# EAGLE design project2 (EAGLE 9.6.2)
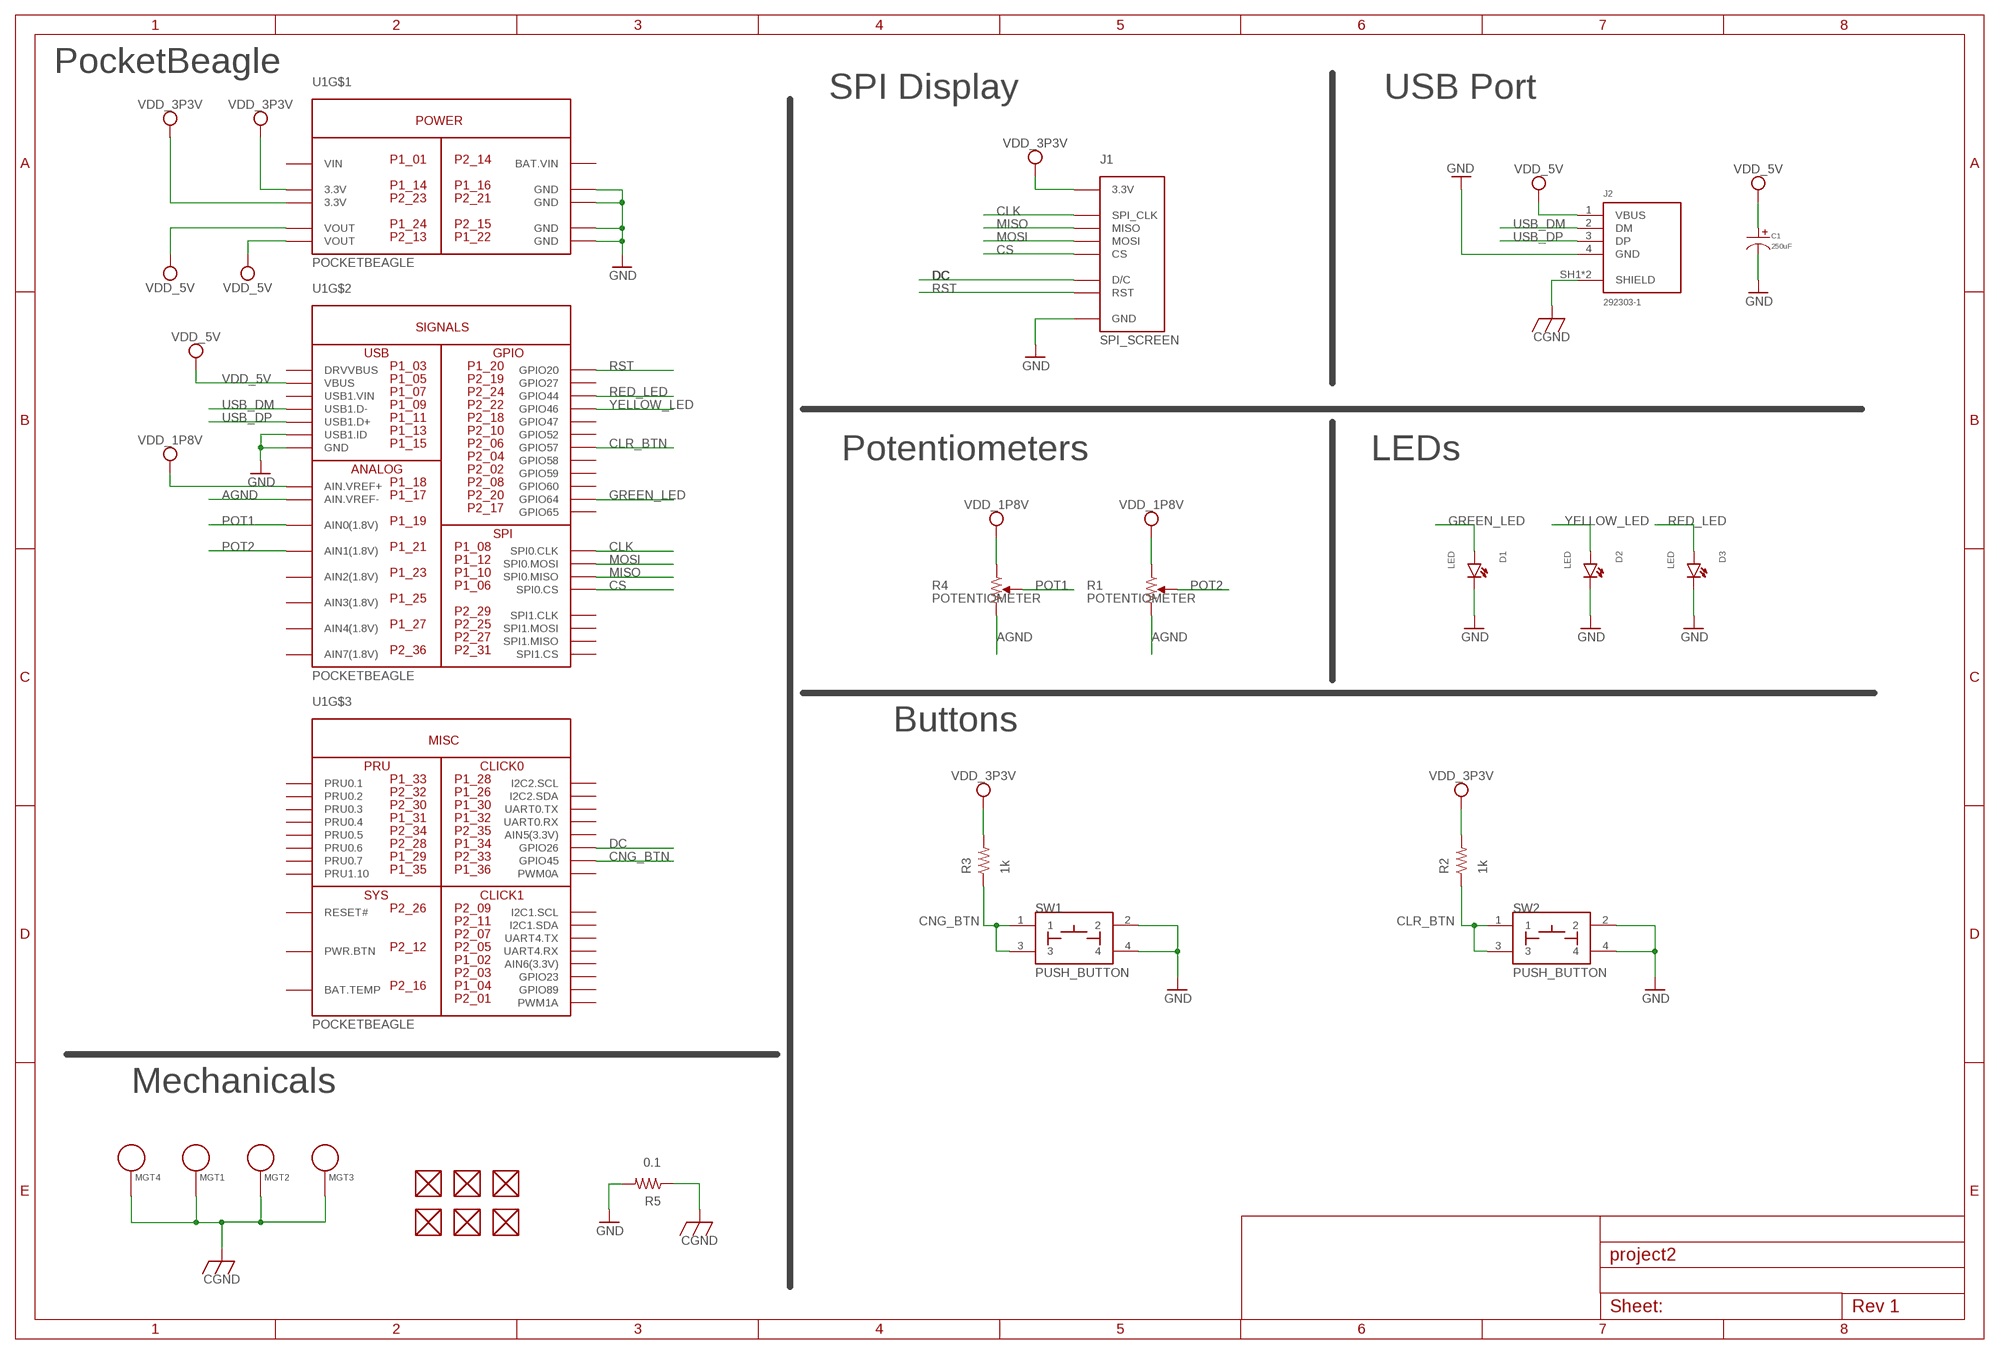
[diagram p0: schematic, sheet 1]

## Parts
C1  250uF  CAPACITOR_P_10MM  [CP10MM]
D1  LED  [EIA-STD]
D2  LED  [EIA-STD]
D3  LED  [EIA-STD]
FUD1  FIDUCIAL  [FIDUCIAL_40MIL]
FUD2  FIDUCIAL  [FIDUCIAL_40MIL]
FUD3  FIDUCIAL  [FIDUCIAL_40MIL]
FUD4  FIDUCIAL  [FIDUCIAL_40MIL]
FUD5  FIDUCIAL  [FIDUCIAL_40MIL]
FUD6  FIDUCIAL  [FIDUCIAL_40MIL]
J1  SPI_SCREEN  [SPI_SCREEN]
J2  292303-1  [TE_292303-1]
MGT1  MOUNTING_HOLE  [MOUNTING_HOLE]
MGT2  MOUNTING_HOLE  [MOUNTING_HOLE]
MGT3  MOUNTING_HOLE  [MOUNTING_HOLE]
MGT4  MOUNTING_HOLE  [MOUNTING_HOLE]
R1  POTENTIOMETER  [POT-PO90S]
R2  1k  R_R0603  [R0603]
R3  1k  R_R0603  [R0603]
R4  POTENTIOMETER  [POT-PO90S]
R5  0.1  R_R0603  [R0603]
SW1  PUSH_BUTTON  [BUTTON_12.5MM]
SW2  PUSH_BUTTON  [BUTTON_12.5MM]
U1  POCKETBEAGLE  [POCKETBEAGLE]

## Nets
AGND: R1.CW R4.CW U1.17@P1(AIN.VREF-)
CGND: J2.SH1(SHIELD) J2.SH2(SHIELD) MGT1.P$1 MGT2.P$1 MGT3.P$1 MGT4.P$1 R5.1
CLK: J1.4@JP2(SPI_CLK) U1.8@P1(SPI0.CLK)
CLR_BTN: R2.1 SW2.1 SW2.3 U1.6@P2(GPIO57)
CNG_BTN: R3.1 SW1.1 SW1.3 U1.33@P2(GPIO45)
CS: J1.7@JP2(CS) U1.6@P1(SPI0.CS)
DC: J1.8@JP2(D/C) U1.34@P1(GPIO26)
GND: C1.P$2 D1.CATHODE D2.CATHODE D3.CATHODE J1.1@JP2(GND) J2.4(GND) R5.2 SW1.2 SW1.4 SW2.2 SW2.4 U1.13@P1(USB1.ID) U1.15@P1(GND) U1.15@P2(GND) U1.16@P1(GND) U1.21@P2(GND) U1.22@P1(GND)
GREEN_LED: D1.ANODE U1.20@P2(GPIO64)
MISO: J1.5@JP2(MISO) U1.10@P1(SPI0.MISO)
MOSI: J1.6@JP2(MOSI) U1.12@P1(SPI0.MOSI)
POT1: R4.S U1.19@P1(AIN0(1.8V))
POT2: R1.S U1.21@P1(AIN1(1.8V))
RED_LED: D3.ANODE U1.24@P2(GPIO44)
RST: J1.9@JP2(RST) U1.20@P1(GPIO20)
USB_DM: J2.2(DM) U1.9@P1(USB1.D-)
USB_DP: J2.3(DP) U1.11@P1(USB1.D+)
VDD_1P8V: R1.CCW R4.CCW U1.18@P1(AIN.VREF+)
VDD_3P3V: J1.3@JP2(3.3V) R2.2 R3.2 U1.14@P1(3.3V) U1.23@P2(3.3V)
VDD_5V: C1.P$1 J2.1(VBUS) U1.5@P1(VBUS) U1.13@P2(VOUT) U1.24@P1(VOUT)
YELLOW_LED: D2.ANODE U1.22@P2(GPIO46)
Unconnected: FUD1.P$1 FUD2.P$1 FUD3.P$1 FUD4.P$1 FUD5.P$1 FUD6.P$1 U1.1@P2(PWM1A) U1.2@P1(AIN6(3.3V)) U1.2@P2(GPIO59) U1.3@P1(DRVVBUS) U1.3@P2(GPIO23) U1.4@P1(GPIO89) U1.4@P2(GPIO58) U1.5@P2(UART4.RX) U1.7@P1(USB1.VIN) U1.7@P2(UART4.TX) U1.8@P2(GPIO60) U1.9@P2(I2C1.SCL) U1.10@P2(GPIO52) U1.11@P2(I2C1.SDA) U1.12@P2(PWR.BTN) U1.16@P2(BAT.TEMP) U1.17@P2(GPIO65) U1.18@P2(GPIO47) U1.19@P2(GPIO27) U1.23@P1(AIN2(1.8V)) U1.25@P1(AIN3(1.8V)) U1.25@P2(SPI1.MOSI) U1.26@P1(I2C2.SDA) U1.26@P2(RESET#) U1.27@P1(AIN4(1.8V)) U1.27@P2(SPI1.MISO) U1.28@P1(I2C2.SCL) U1.28@P2(PRU0.6) U1.29@P1(PRU0.7) U1.29@P2(SPI1.CLK) U1.30@P1(UART0.TX) U1.30@P2(PRU0.3) U1.31@P1(PRU0.4) U1.31@P2(SPI1.CS) U1.32@P1(UART0.RX) U1.32@P2(PRU0.2) U1.33@P1(PRU0.1) U1.34@P2(PRU0.5) U1.35@P1(PRU1.10) U1.35@P2(AIN5(3.3V)) U1.36@P1(PWM0A) U1.36@P2(AIN7(1.8V))

## Notes on the sheet
- PocketBeagle
- SPI Display | USB Port
- Potentiometers | LEDs
- Buttons
- Mechanicals

## Power pins joined to a net without a drawn wire
BAT.VIN: U1.14@P2(BAT.VIN)
VIN: U1.1@P1(VIN)

## Library data of the parts
C1 = combo_lock:CAPACITOR_P: Library: MF_Passives Description: Device for Polarized Capacitors. Manufacture part number (MPN), Voltage Rating, and Tolerance can be added via Attributes. Check https://factory.macrofab.com/parts for the house parts list.; POPULATE: 1
D1-D3 = project2:LED: EIA-STD LED, LTST-C191TBKT
FUD1-FUD6 = project2:FIDUCIAL
J1 = project2:SPI_SCREEN: 2.8" Adafruit SPI Display
J2 = project2:292303-1: CONN USB RECEPT R/A TYPE A 4POS Check prices <https://pricing.snapeda.com/parts/292303-1/TE%20Connectivity/view-part?ref=eda>; AVAILABILITY: In Stock; COMMENT: 292303-1; DESCRIPTION: Conn; Data; USB; Recept; 2.0; 4 Pos; 1 Port; Rt Angle; A Ser; Tin over Copper; MF: TE Connectivity; MP: 292303-1; PACKAGE: None; PRICE: None; PURCHASE-URL: https://pricing.snapeda.com/search/part/292303-1/?ref=eda
MGT1-MGT4 = project2:MOUNTING_HOLE: Chassis Mounting Hole w/GND connection ability
R1 R4 = project2:POTENTIOMETER: Potentiometer - Examples: P090S-14T20BR10K (987-1277-ND)
R2 R3 R5 = project2:R_: RESISTOR, American symbol
SW1 SW2 = project2:PUSH_BUTTON
U1 = project2:POCKETBEAGLE: PocketBeagle

## Board
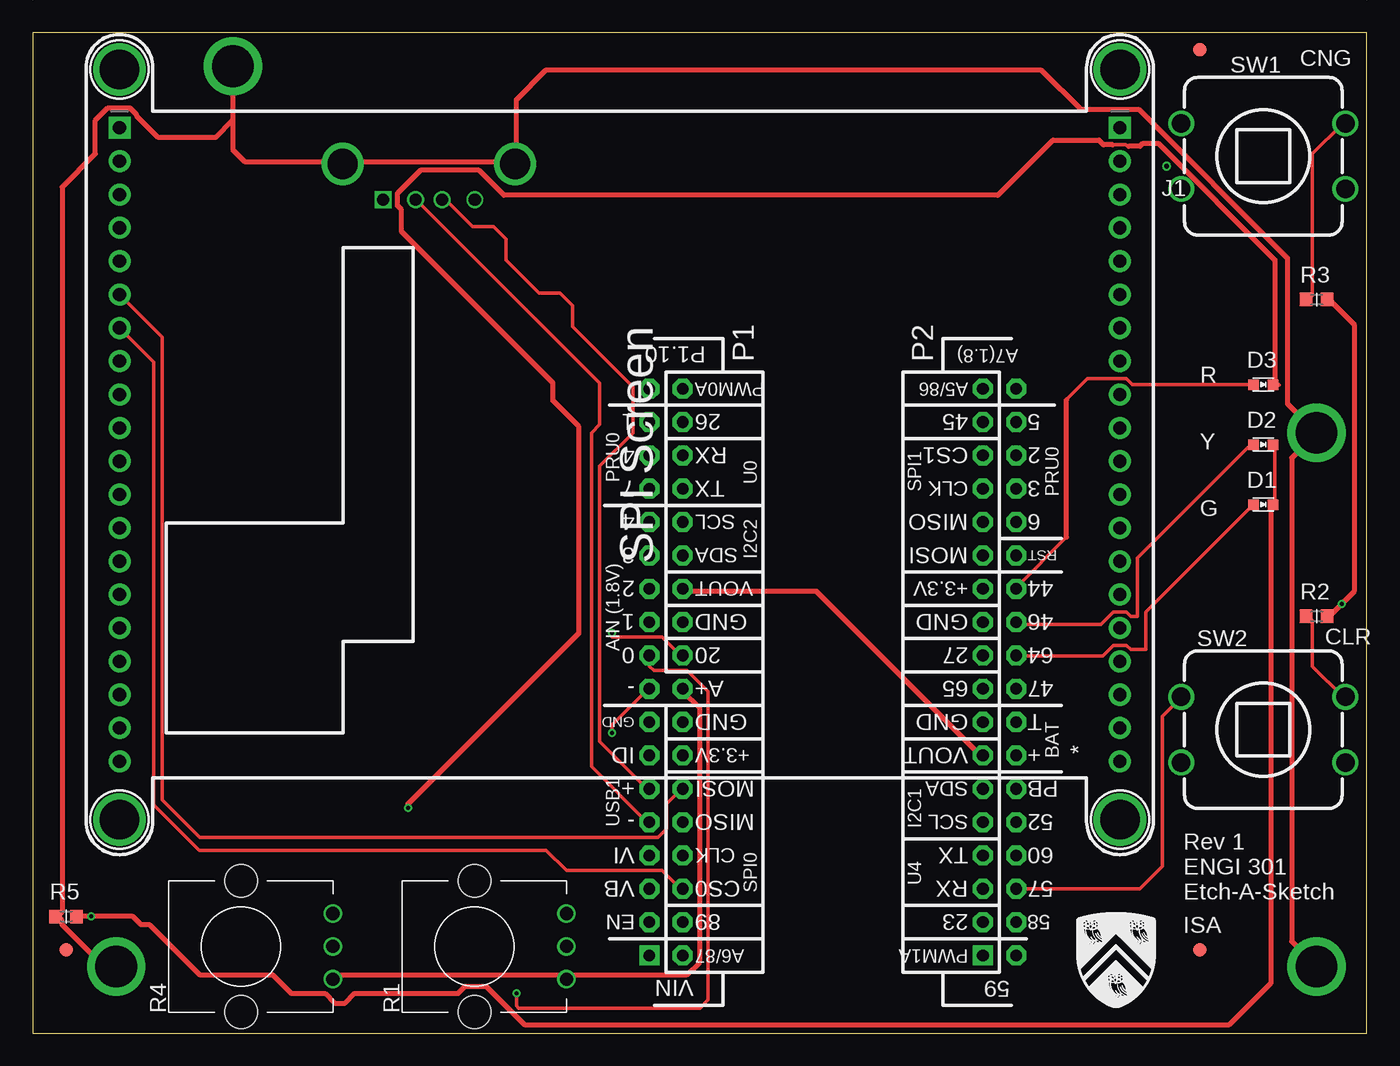
[diagram p1: board, top side]
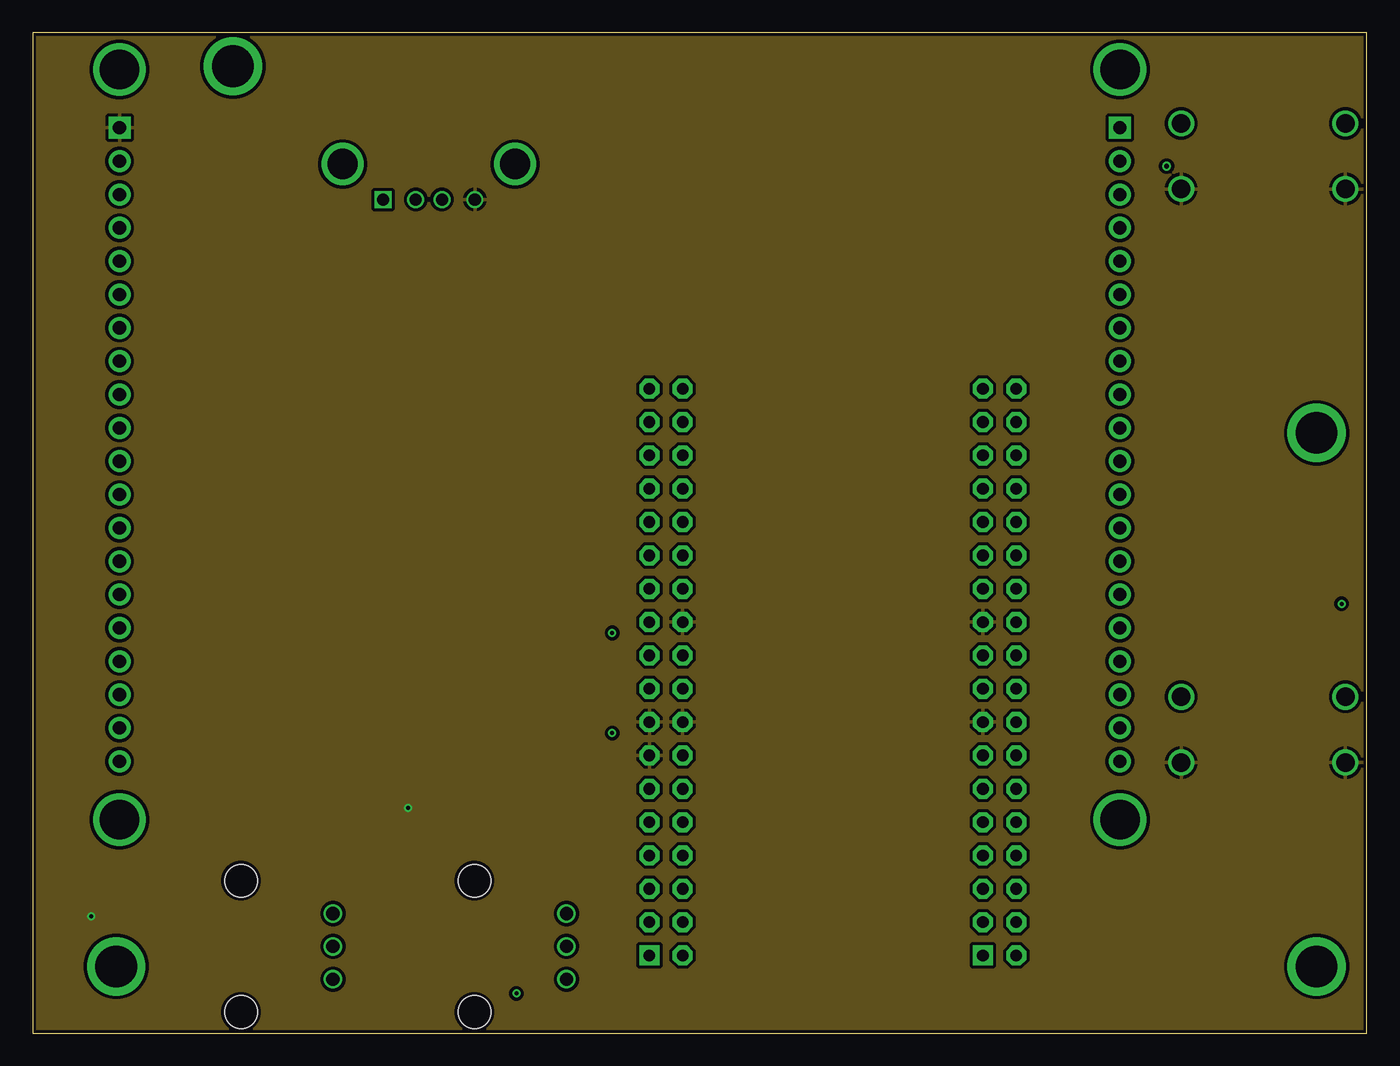
[diagram p2: board, inner layer Route2]
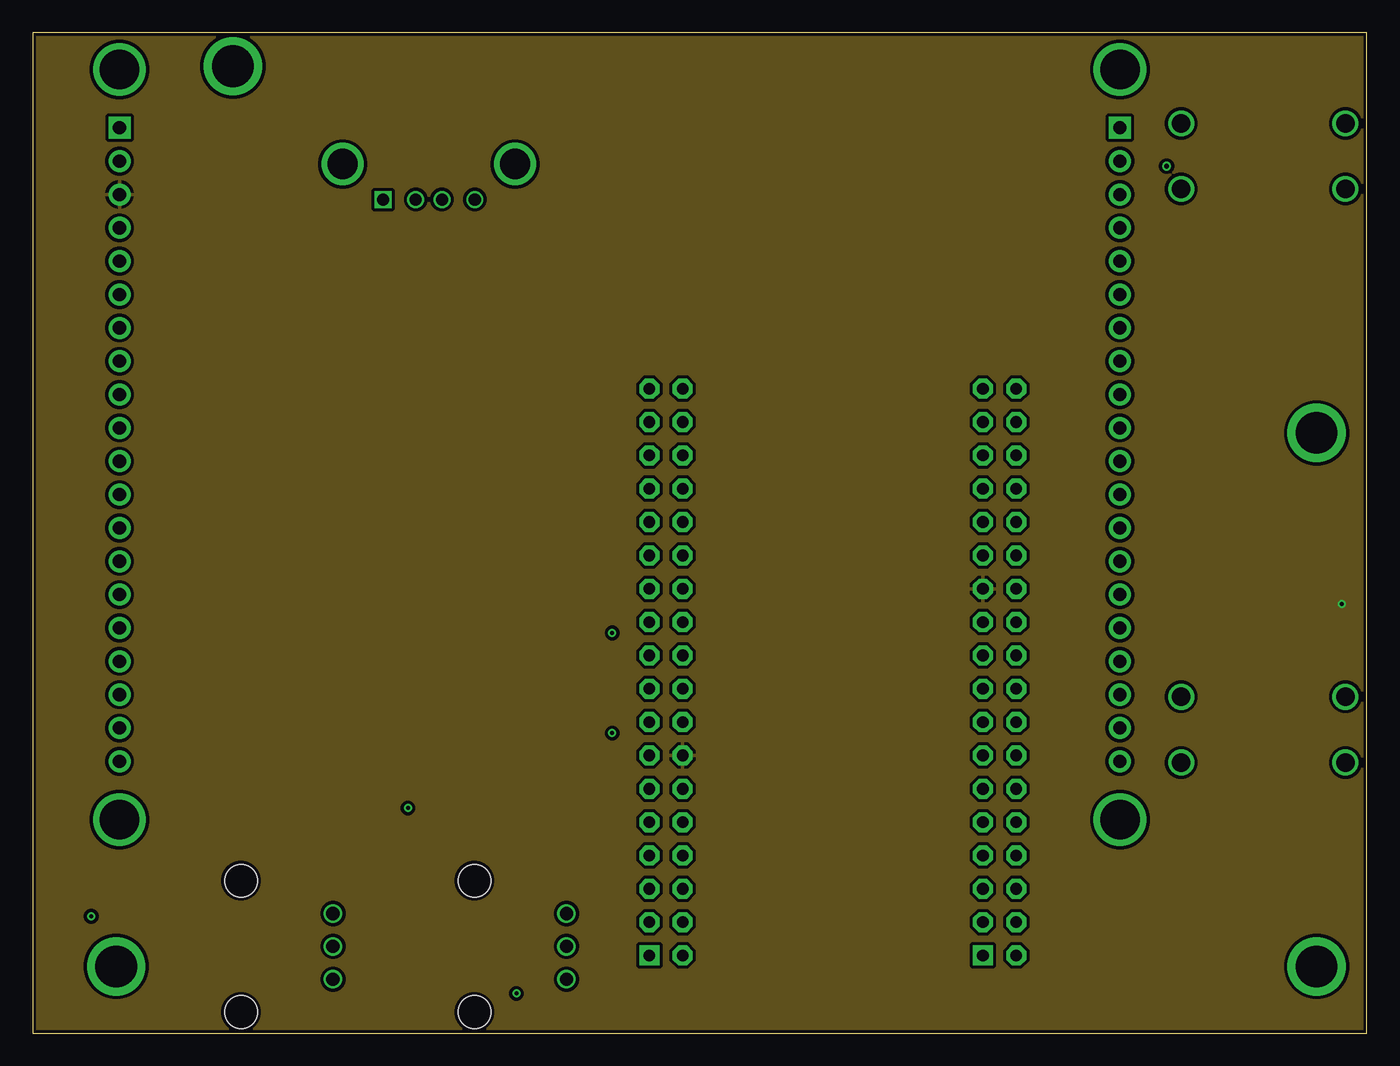
[diagram p3: board, inner layer Route15]
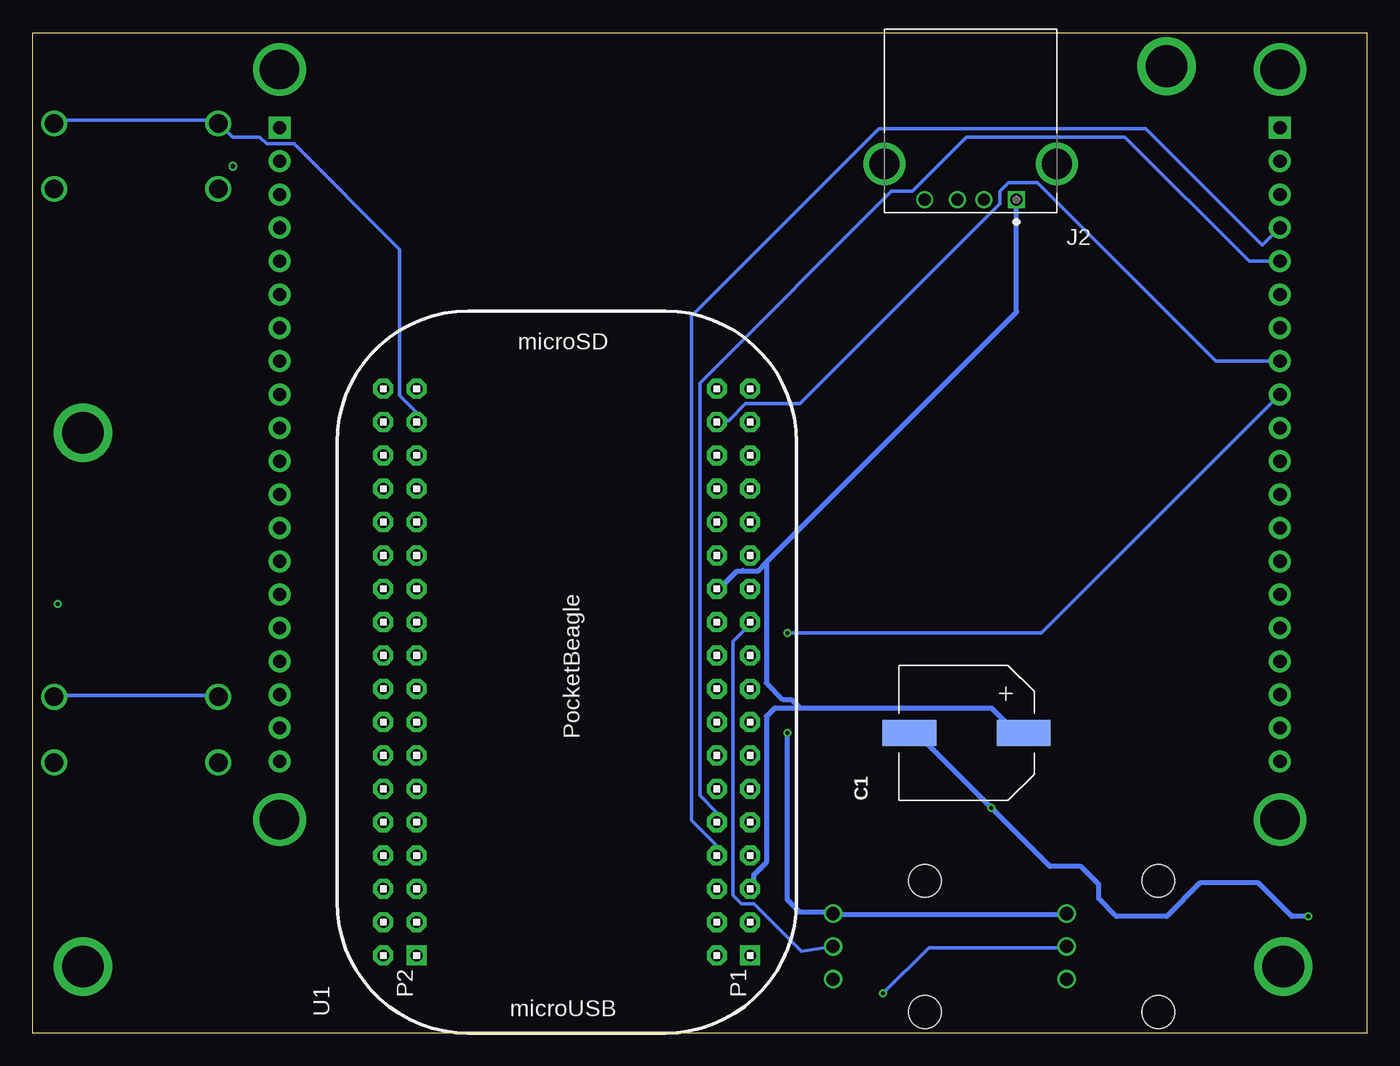
[diagram p4: board, bottom side, seen from below]

Size 101.6 x 76.2 mm. Coordinates in mm from the lower left corner, seen from the top.
Outline: 0,0 101.6,0 101.6,76.2 0,76.2 0,0
Copper layers (1*2*15*16): Top 0.035mm / dielectric 0.23mm / Route2 0.035mm / dielectric 0.93mm / Route15 0.035mm / dielectric 0.23mm / Bottom 0.035mm
Design rules "ENGI301_4lyr": minimum track width 10mil, minimum drill 12mil, track to track 10mil, track to pad 10mil, pad to pad 10mil, via to via 10mil, smd to smd 10mil, copper to edge 10mil, drill to drill 12mil, minimum pad ring 6mil, minimum via ring 6mil, stop-mask expansion 3mil, vias tented up to drill 25mil, thermal gap 10mil

### Footprints (pad centres in the part's own frame; a part is rotated, then mirrored left to right if it is on the bottom)
CP10MM = smd 2 x 4.1: P$1 0,-4.35; P$2 0,4.35
EIA-STD = smd 0.8 x 0.8: ANODE -0.75,0; CATHODE 0.75,0
FIDUCIAL_40MIL = smd 1.016 x 1.016: P$1 0,0
SPI_SCREEN = drill 1 pad 1.676 square: 1@JP1 -24.13,38.1; 1@JP2 -24.13,-38.1 | drill 1 pad 1.676: 2@JP1 -21.59,38.1; 2@JP2 -21.59,-38.1; 3@JP1 -19.05,38.1; 3@JP2 -19.05,-38.1; 4@JP1 -16.51,38.1; 4@JP2 -16.51,-38.1; 5@JP1 -13.97,38.1; 5@JP2 -13.97,-38.1; 6@JP1 -11.43,38.1; 6@JP2 -11.43,-38.1; 7@JP1 -8.89,38.1; 7@JP2 -8.89,-38.1; 8@JP1 -6.35,38.1; 8@JP2 -6.35,-38.1; 9@JP1 -3.81,38.1; 9@JP2 -3.81,-38.1; 10@JP1 -1.27,38.1; 10@JP2 -1.27,-38.1; 11@JP1 1.27,38.1; 11@JP2 1.27,-38.1; 12@JP1 3.81,38.1; 12@JP2 3.81,-38.1; 13@JP1 6.35,38.1; 13@JP2 6.35,-38.1; 14@JP1 8.89,38.1; 14@JP2 8.89,-38.1; 15@JP1 11.43,38.1; 15@JP2 11.43,-38.1; 16@JP1 13.97,38.1; 16@JP2 13.97,-38.1; 17@JP1 16.51,38.1; 17@JP2 16.51,-38.1; 18@JP1 19.05,38.1; 18@JP2 19.05,-38.1; 19@JP1 21.59,38.1; 19@JP2 21.59,-38.1; 20@JP1 24.13,38.1; 20@JP2 24.13,-38.1 | drill 3 pad 3.6: P$1@U$7 -28.575,-38.1; P$1@U$15 28.575,-38.1; P$1@U$16 -28.575,38.1; P$1@U$17 28.575,38.1
TE_292303-1 = drill 0.92 square: 1 0,0 | drill 0.92: 2 2.5,0; 3 4.5,0; 4 7,0 | drill 2.3: SH1 -3.07,-2.71; SH2 10.07,-2.71
MOUNTING_HOLE = drill 3.175 pad 4.445: P$1 0,0
POT-PO90S = drill 1: CCW -2.5,0; CW 2.5,0; S 0,0 | hole 2.5: -5,7; 5,7
R0603 = smd 0.95 x 1.031: 1 -0.8,0; 2 0.8,0
BUTTON_12.5MM = drill 1.4: 1 -6.25,2.5; 2 -6.25,-2.5; 3 6.25,2.5; 4 6.25,-2.5
POCKETBEAGLE = drill 0.889 pad 1.524 square: 1@P1 5.91,3.53; 1@P2 5.91,28.93 | drill 0.889 pad 1.524 octagon: 2@P1 5.91,6.07; 2@P2 5.91,31.47; 3@P1 8.45,3.53; 3@P2 8.45,28.93; 4@P1 8.45,6.07; 4@P2 8.45,31.47; 5@P1 10.99,3.53; 5@P2 10.99,28.93; 6@P1 10.99,6.07; 6@P2 10.99,31.47; 7@P1 13.53,3.53; 7@P2 13.53,28.93; 8@P1 13.53,6.07; 8@P2 13.53,31.47; 9@P1 16.07,3.53; 9@P2 16.07,28.93; 10@P1 16.07,6.07; 10@P2 16.07,31.47; 11@P1 18.61,3.53; 11@P2 18.61,28.93; 12@P1 18.61,6.07; 12@P2 18.61,31.47; 13@P1 21.15,3.53; 13@P2 21.15,28.93; 14@P1 21.15,6.07; 14@P2 21.15,31.47; 15@P1 23.69,3.53; 15@P2 23.69,28.93; 16@P1 23.69,6.07; 16@P2 23.69,31.47; 17@P1 26.23,3.53; 17@P2 26.23,28.93; 18@P1 26.23,6.07; 18@P2 26.23,31.47; 19@P1 28.77,3.53; 19@P2 28.77,28.93; 20@P1 28.77,6.07; 20@P2 28.77,31.47; 21@P1 31.31,3.53; 21@P2 31.31,28.93; 22@P1 31.31,6.07; 22@P2 31.31,31.47; 23@P1 33.85,3.53; 23@P2 33.85,28.93; 24@P1 33.85,6.07; 24@P2 33.85,31.47; 25@P1 36.39,3.53; 25@P2 36.39,28.93; 26@P1 36.39,6.07; 26@P2 36.39,31.47; 27@P1 38.93,3.53; 27@P2 38.93,28.93; 28@P1 38.93,6.07; 28@P2 38.93,31.47; 29@P1 41.47,3.53; 29@P2 41.47,28.93; 30@P1 41.47,6.07; 30@P2 41.47,31.47; 31@P1 44.01,3.53; 31@P2 44.01,28.93; 32@P1 44.01,6.07; 32@P2 44.01,31.47; 33@P1 46.55,3.53; 33@P2 46.55,28.93; 34@P1 46.55,6.07; 34@P2 46.55,31.47; 35@P1 49.09,3.53; 35@P2 49.09,28.93; 36@P1 49.09,6.07; 36@P2 49.09,31.47

### Placement (x,y rotation side)
C1  30.48,22.86 90 bottom
D1  93.73,40.26 0 top
D2  93.73,44.83 0 top
D3  93.73,49.4 0 top
FUD1  88.9,6.35 0 top
FUD2  2.54,6.35 0 top
FUD3  88.9,74.93 0 top
FUD4  40.64,-21.59 0 top  (outside the outline)
FUD5  40.64,-24.13 0 top  (outside the outline)
FUD6  40.64,-26.67 0 top  (outside the outline)
J1  44.7,44.83 270 top
J2  26.67,63.5 180 bottom
MGT1  6.35,5.08 0 top
MGT2  97.79,5.08 0 top
MGT3  97.79,45.72 0 top
MGT4  15.24,73.66 0 top
R1  40.64,6.6 90 top
R2  97.79,31.75 0 top
R3  97.79,55.88 0 top
R4  22.86,6.6 90 top
R5  2.54,8.89 0 top
SW1  93.73,66.8 0 top
SW2  93.73,23.11 0 top
U1  43.43,0 90 bottom

### Tracks (layer width: path | path; a pad name or v marks a point on that pad's centre or on a via)
AGND  (via drill 0.3)
  Top 0.254: v44.13,22.86 44.13,23.5 46.67,26.04 46.77,26.04 U1.17@P1
  Bottom 0.254: R1.CW 41.12,9.21
  Bottom 0.381: v44.13,22.86 44.13,10.16 43.18,9.21 41.12,9.21 | R4.CW 22.86,9.05 40.31,9.05 R1.CW
CGND
  Top 0.254: 1.91,8.89 R5.1 | 23.5,66.31 23.5,66.36 | J2.SH2 36.66,66.21
  Top 0.381: MGT2.P$1 95.89,6.99 95.89,43.81 MGT3.P$1 95.57,47.94 95.57,59.05 84.3,70.33 79.85,70.33 76.83,73.34 39.05,73.34 36.83,71.12 36.83,66.36 36.74,66.27 J2.SH2 | MGT1.P$1 5.4,5.08 2.22,8.26 2.22,8.57 1.91,8.89 2.22,9.21 2.22,64.45 4.76,66.99 4.76,69.53 5.71,70.48 7.38,70.48 7.89,69.98 7.89,69.9 9.53,68.26 13.97,68.26 15.24,69.53 | MGT4.P$1 15.24,69.53 | 15.24,69.53 15.24,67.31 16.19,66.36 23.5,66.36 | 23.5,66.31 J2.SH1 23.75,66.36 36.51,66.36 36.66,66.21
CLK
  Bottom 0.254: J1.4@JP2 7.94,60.01 16.83,68.9 37.15,68.9 51.44,54.61 51.44,16.19 49.53,14.29 49.53,13.65 49.5,13.63 U1.8@P1
CLR_BTN
  Top 0.254: R2.1 97.16,31.75 97.47,31.43 97.47,27.94 99.8,25.61 SW2.3 | U1.6@P2 84.33,10.99 86.04,12.7 86.04,24.13 87.48,25.56 SW2.1
  Bottom 0.254: SW2.1 87.58,25.72 99.69,25.72 99.8,25.61 SW2.3
CNG_BTN
  Top 0.254: R3.1 97.16,55.88 97.47,56.2 97.47,66.99 99.69,69.22 99.89,69.22 SW1.3
  Bottom 0.254: SW1.3 99.92,69.3 99.69,69.53 87.63,69.53 87.48,69.38 SW1.1 87.39,69.22 87.31,69.22 86.36,68.26 84.32,68.26 83.8,67.74 82.42,67.74 81.71,67.74 73.66,59.69 73.66,48.58 72.39,47.31 72.39,46.67 72.36,46.65 U1.33@P2
CS
  Top 0.254: J1.7@JP2 9.21,51.12 9.21,17.38 12.66,13.93 39.09,13.93 40.64,12.38 47.94,12.38 49.34,10.99 U1.6@P1
DC
  Bottom 0.254: U1.34@P1 49.34,46.55 49.21,46.67 48.58,46.67 47.31,47.94 43.18,47.94 27.94,63.18 27.94,64.14 27.3,64.77 25.08,64.77 11.49,51.18 J1.8@JP2
GND  (via drill 0.3)
  Top 0.254: 94.61,49.37 94.93,49.37 94.9,49.4 D3.CATHODE | D2.CATHODE 94.54,44.77 94.61,44.77 94.61,40.32 94.54,40.32 D1.CATHODE 94.48,40.18 94.3,40.01 | 83.47,67.56 83.39,67.56 83.27,67.68 82.25,67.68
  Top 0.381: R5.2 v4.45,8.89 7.62,8.89 8.26,8.26 8.89,8.26 12.7,4.45 18.26,4.45 19.68,3.02 22.25,3.02 22.99,2.29 23.77,2.29 24.51,3.02 32.41,3.02 32.94,3.55 34.53,3.55 37.45,0.64 91.12,0.64 94.3,3.81 94.3,40.01 | v28.57,17.14 28.57,17.46 41.59,30.48 41.59,46.2 39.61,48.18 39.61,49.53 28.08,61.06 28.08,62.72 27.78,63.02 27.78,63.98 29.53,65.72 33.97,65.72 35.88,63.82 73.5,63.82 77.71,68.02 81.21,68.02 81.55,67.68 82.25,67.68 | 94.61,49.37 94.61,58.9 85.77,67.74 84.51,67.74 84.33,67.56 83.47,67.56
  Bottom 0.254: 34.29,22.86 C1.P$2
  Bottom 0.381: 34.29,22.86 v28.57,17.14 24.13,12.7 21.78,12.7 20.41,11.34 20.41,10.25 19.05,8.89 15.24,8.89 12.7,11.43 8.26,11.43 5.71,8.89 v4.45,8.89
  pour Route2: -5.08,81.28 106.68,81.28 106.68,-5.08 -5.08,-5.08
GREEN_LED
  Top 0.254: D1.ANODE 92.72,40.01 92.71,40.01 84.77,32.07 84.77,29.21 83.64,29.21 83.31,29.54 82.3,29.54 81.5,28.74 74.93,28.74 U1.20@P2
MISO
  Bottom 0.254: U1.10@P1 49.5,16.17 49.53,16.19 49.53,16.83 50.8,18.1 50.8,49.53 36.2,64.14 34.61,64.14 30.48,68.26 18.41,68.26 8.95,58.8 J1.5@JP2
MOSI
  Top 0.254: J1.6@JP2 9.84,53.02 9.84,17.78 12.7,14.92 47.62,14.92 48.26,15.56 48.26,17.46 49.21,18.41 49.31,18.41 U1.12@P1
N$2  (via drill 0.35)
  other vias: 86.36,66.04
POT1  (via drill 0.3)
  Top 0.254: U1.19@P1 46.99,28.74 46.99,27.94 47.31,27.62 49.85,27.62 51.44,26.04 51.44,2.54 50.8,1.91 36.99,1.91 36.83,2.06 v36.83,3.02
  Bottom 0.254: v36.83,3.02 33.34,6.51 22.86,6.51 R4.S
POT2
  Bottom 0.254: U1.21@P1 46.99,31.28 46.99,31.11 48.26,29.84 48.26,10.48 47.62,9.84 46.67,9.84 43.05,6.22 R1.S
RED_LED
  Top 0.254: U1.24@P2 74.9,33.95 78.74,37.78 | D3.ANODE 83.77,49.4 83.31,49.86 80.34,49.86 78.74,48.26
  Top 0.381: 78.74,37.78 78.74,48.26
RST  (via drill 0.3)
  Top 0.254: v44.13,30.48 44.13,30.16 47.94,30.16 49.34,28.77 U1.20@P1
  Bottom 0.254: v44.13,30.48 24.77,30.48 J1.9@JP2
USB_DM
  Top 0.254: J2.2 29.21,63.5 43.18,49.53 43.18,46.35 42.55,45.72 42.55,20.32 46.8,16.07 U1.9@P1
USB_DP
  Top 0.254: J2.3 31.43,63.5 33.5,61.44 35.08,61.44 36.04,60.48 36.04,58.9 38.58,56.36 40.16,56.36 41.12,55.4 41.12,53.82 45.72,49.21 45.72,45.72 43.18,43.18 43.18,22.23 46.8,18.61 U1.11@P1
VDD_1P8V
  Top 0.381: 40.64,4.45 22.86,4.45 R4.CCW | 40.64,4.45 49.85,4.45 50.8,5.4 50.8,24.77 49.53,26.04 49.53,26.2 U1.18@P1 | 40.64,4.45 R1.CCW
VDD_3P3V  (via drill 0.3)
  Top 0.254: 98.74,31.75 R2.2 | 98.74,55.88 R3.2
  Top 0.381: 98.74,31.75 v99.69,32.7 100.65,33.66 100.65,53.98 98.74,55.88
  pour Route15: -7.62,83.82 109.22,83.82 109.22,-7.62 -7.62,-7.62
VDD_5V
  Top 0.254: 49.53,33.82 49.53,33.66 | U1.13@P2 72.19,21.15
  Top 0.381: 49.53,33.66 59.69,33.66 72.19,21.15 | U1.24@P1 49.53,33.82
  Bottom 0.254: U1.5@P1 46.8,10.99 | 49.34,33.85 U1.24@P1 | 26.67,22.86 C1.P$1
  Bottom 0.381: J2.1 26.67,54.93 45.72,35.88 | 45.72,35.88 45.72,26.67 44.45,25.4 43.81,25.4 43.18,24.77 | 46.8,10.99 46.67,11.11 46.67,12.06 45.72,13.02 45.72,24.13 45.09,24.77 43.18,24.77 | 26.67,22.86 28.57,24.77 43.18,24.77 | 47.46,35.18 47.52,35.24 | 45.72,35.88 46.41,35.18 47.46,35.18 | 47.46,35.18 48,35.18 49.34,33.85
YELLOW_LED
  Top 0.254: U1.22@P2 74.93,31.28 74.93,31.11 81.33,31.11 82.3,32.08 83.31,32.08 83.64,31.75 84.14,31.75 84.14,36.2 92.55,44.61 92.75,44.61 D2.ANODE

### Text on the board
tPlace: CNG | R | Y | G | CLR | Rev 1 | ENGI 301 / Etch-A-Sketch | ISA